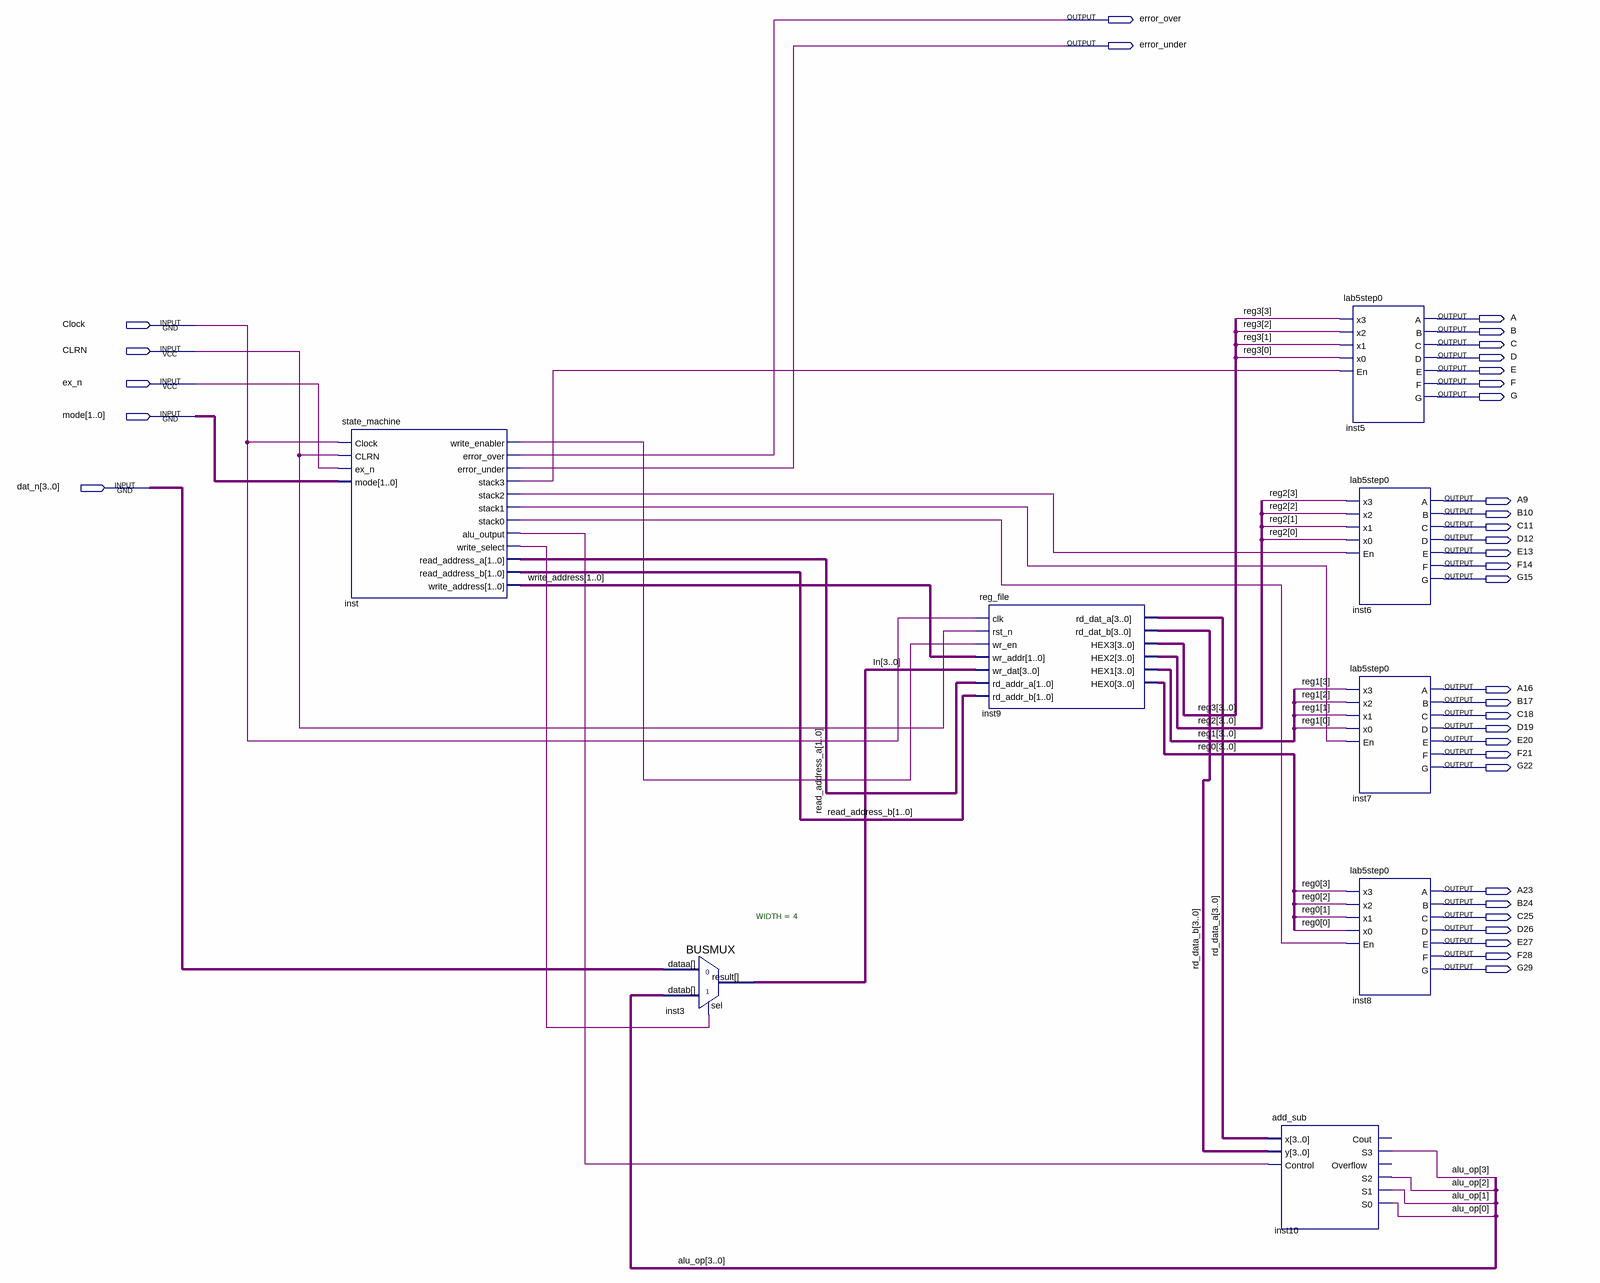
[diagram p0: schematic sheet]
// Quartus schematic Final_Project.bdf as structural Verilog: 8 symbols, 35 pins
module Final_Project (
  input  Clock,
  input  CLRN,
  input  ex_n,
  input  [1:0] mode,
  input  [3:0] dat_n,
  output error_over,
  output error_under,
  output A,
  output B,
  output C,
  output D,
  output E,
  output F,
  output G,
  output A9,
  output B10,
  output C11,
  output D12,
  output E13,
  output F14,
  output G15,
  output A16,
  output B17,
  output C18,
  output D19,
  output E20,
  output F21,
  output G22,
  output A23,
  output B24,
  output C25,
  output D26,
  output E27,
  output F28,
  output G29
);

  wire inst_alu_output, inst_stack0, inst_stack1, inst_stack2, inst_stack3, inst_write_enabler,
       inst_write_select;
  wire [1:0] read_address_a, read_address_b, write_address;
  wire [3:0] alu_op, In, rd_data_a, rd_data_b, reg0, reg1, reg2, reg3;

  state_machine inst (
    .Clock(Clock), .CLRN(CLRN), .ex_n(ex_n), .mode(mode), .write_enabler(inst_write_enabler),
    .error_over(error_over), .error_under(error_under), .stack3(inst_stack3), .stack2(inst_stack2),
    .stack1(inst_stack1), .stack0(inst_stack0), .alu_output(inst_alu_output),
    .write_select(inst_write_select), .read_address_a(read_address_a), .read_address_b(read_address_b),
    .write_address(write_address));
  BUSMUX #(.WIDTH(4)) inst3 (.datab(alu_op), .sel(inst_write_select), .dataa(dat_n), .result(In));
  reg_file inst9 (
    .clk(Clock), .rst_n(CLRN), .wr_en(inst_write_enabler), .wr_addr(write_address), .wr_dat(In),
    .rd_addr_a(read_address_a), .rd_addr_b(read_address_b), .rd_dat_a(rd_data_a), .rd_dat_b(rd_data_b),
    .HEX3(reg3), .HEX2(reg2), .HEX1(reg1), .HEX0(reg0));
  add_sub inst10 (
    .x(rd_data_a), .y(rd_data_b), .Control(inst_alu_output), .S3(alu_op[3]), .S2(alu_op[2]), .S1(alu_op[1]),
    .S0(alu_op[0]));  // open: Cout, Overflow
  lab5step0 inst5 (
    .x3(reg3[3]), .x2(reg3[2]), .x1(reg3[1]), .x0(reg3[0]), .En(inst_stack3), .A(A), .B(B), .C(C), .D(D),
    .E(E), .F(F), .G(G));
  lab5step0 inst6 (
    .x3(reg2[3]), .x2(reg2[2]), .x1(reg2[1]), .x0(reg2[0]), .En(inst_stack2), .A(A9), .B(B10), .C(C11),
    .D(D12), .E(E13), .F(F14), .G(G15));
  lab5step0 inst7 (
    .x3(reg1[3]), .x2(reg1[2]), .x1(reg1[1]), .x0(reg1[0]), .En(inst_stack1), .A(A16), .B(B17), .C(C18),
    .D(D19), .E(E20), .F(F21), .G(G22));
  lab5step0 inst8 (
    .x3(reg0[3]), .x2(reg0[2]), .x1(reg0[1]), .x0(reg0[0]), .En(inst_stack0), .A(A23), .B(B24), .C(C25),
    .D(D26), .E(E27), .F(F28), .G(G29));
endmodule
